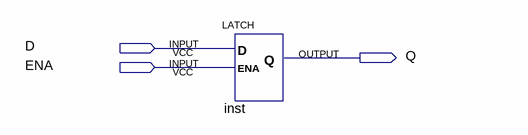
[diagram p0: schematic sheet]
// Quartus schematic lab301LATCH.bdf as structural Verilog: 1 symbols, 3 pins
module lab301LATCH (
  input  D,
  input  ENA,
  output Q
);

  LATCH inst (.D(D), .ENA(ENA), .Q(Q));
endmodule
